# EAGLE design PCB-BMDShieldCon (EAGLE 7.7.0)

## Sheet 1 of 2
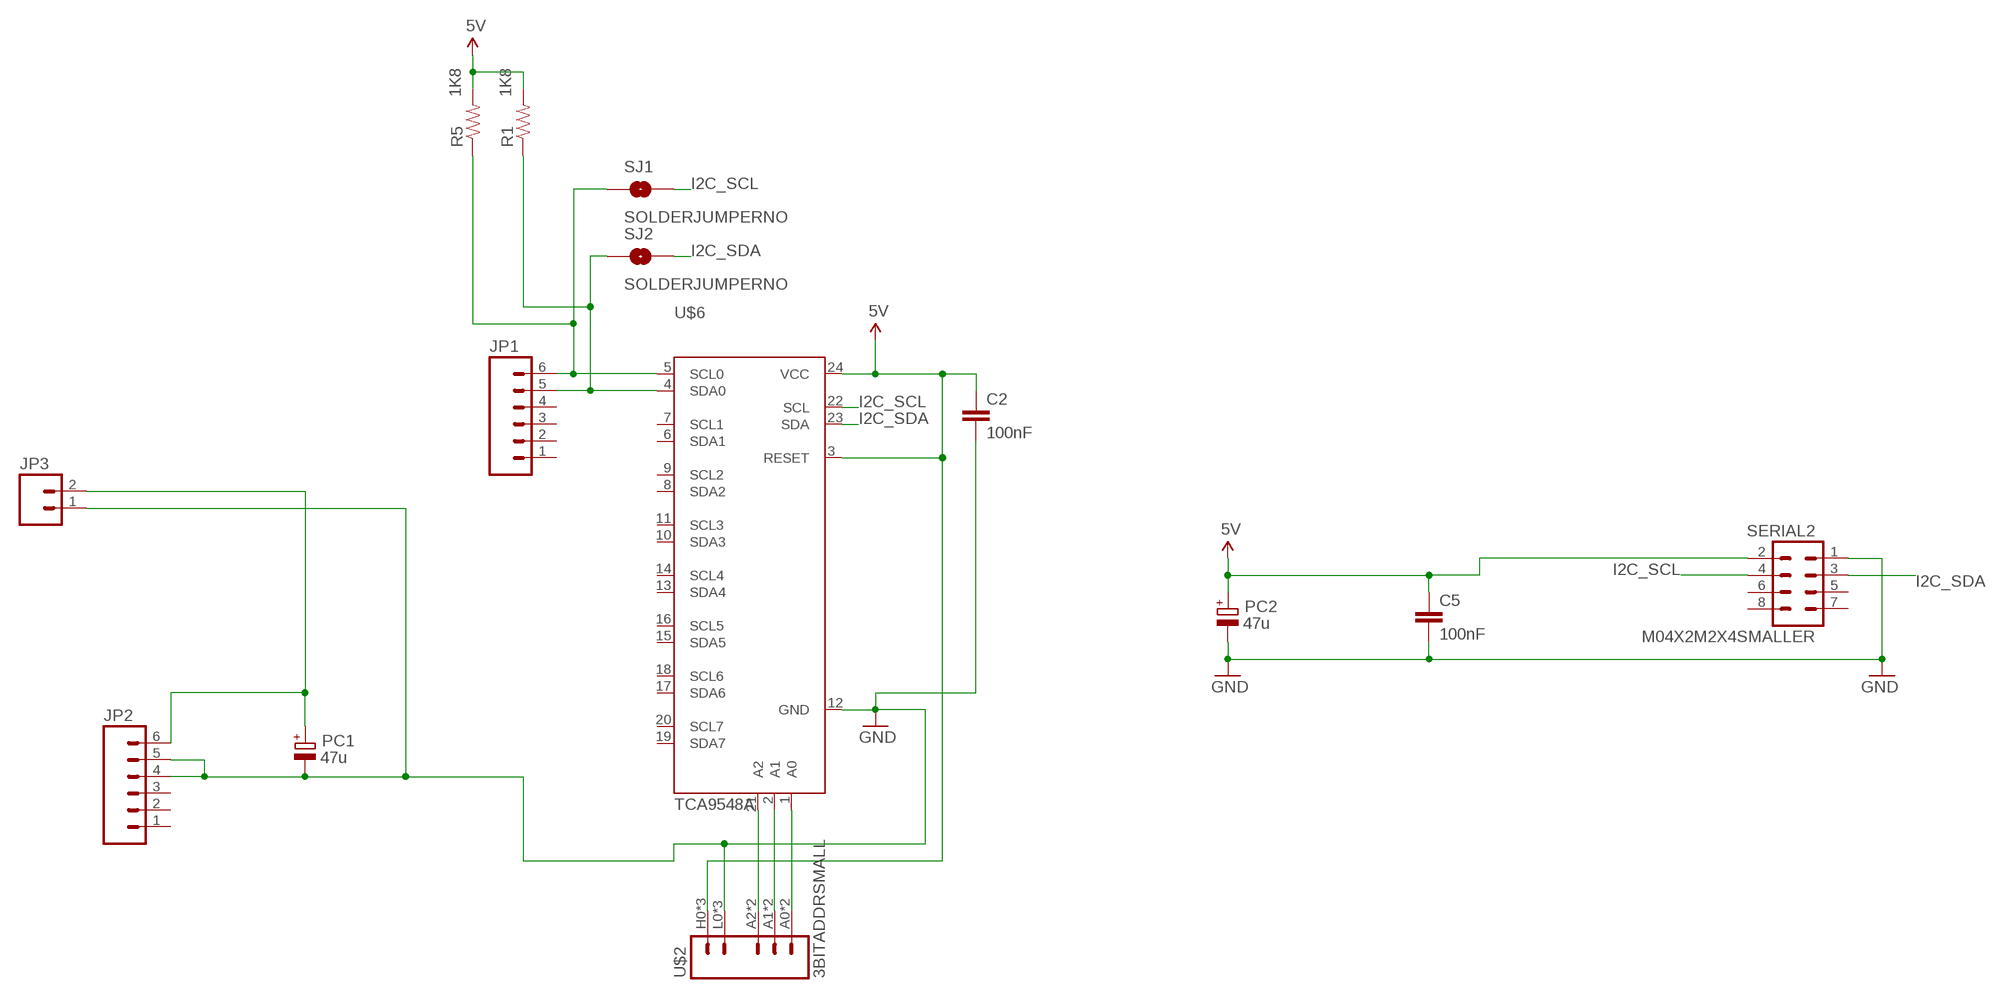
[diagram p0: schematic, sheet 1]

### Parts
C2  100nF  CAP0603-CAP  [0603-CAP]
C5  100nF  CAP0603-CAP  [0603-CAP]
JP1  M06SIP  [1X06]
JP2  M06SIP  [1X06]
JP3  M02PTH4  [1X02_XTRA_BIG]
PC1  47u  CPOL-EUD  [PANASONIC_D]
PC2  47u  CPOL-EUD  [PANASONIC_D]
R1  1K8  RESISTOR0603-RES  [0603-RES]
R5  1K8  RESISTOR0603-RES  [0603-RES]
SERIAL2  M04X2M2X4SMALLER  [M2X4SMALLER]
SJ1  SOLDERJUMPERNO  [SJ_2S-NO]
SJ2  SOLDERJUMPERNO  [SJ_2S-NO]
U$2  3BITADDRSMALL  [3BITADDR_SMALL]
U$6  TCA9548A  [TSSOP24]

### Nets
5V [Power]: C2.1 C5.1 PC2.+ R1.2 R5.2 SERIAL2.2 U$2.H0(VCC) U$2.H1(VCC) U$2.H2(VCC) U$6.3(RESET) U$6.24(VCC)
GND [Power]: C2.2 C5.2 JP2.4 JP2.5 JP3.1 PC1.- PC2.- SERIAL2.1 U$2.L0(GND) U$2.L1(GND) U$2.L2(GND) U$6.12(GND)
I2C_SCL: SERIAL2.4 SJ1.2 U$6.22(SCL)
I2C_SDA: SERIAL2.3 SJ2.2 U$6.23(SDA)
N$1: JP1.6 R5.1 SJ1.1 U$6.5(SCL0)
N$2 [Power]: JP2.6 JP3.2 PC1.+
N$3: JP1.5 R1.1 SJ2.1 U$6.4(SDA0)
N$4: U$2.A0 U$2.AS0(A0) U$6.1(A0)
N$5: U$2.A1 U$2.AS1(A1) U$6.2(A1)
N$6: U$2.A2 U$2.AS2(A2) U$6.21(A2)
Unconnected: JP1.1 JP1.2 JP1.3 JP1.4 JP2.1 JP2.2 JP2.3 SERIAL2.5 SERIAL2.6 SERIAL2.7 SERIAL2.8 U$6.6(SDA1) U$6.7(SCL1) U$6.8(SDA2) U$6.9(SCL2) U$6.10(SDA3) U$6.11(SCL3) U$6.13(SDA4) U$6.14(SCL4) U$6.15(SDA5) U$6.16(SCL5) U$6.17(SDA6) U$6.18(SCL6) U$6.19(SDA7) U$6.20(SCL7)

## Sheet 2 of 2

## Library data of the parts
C2 C5 = SparkFun:CAP: Capacitor Standard 0603 ceramic capacitor, and 0.1" leaded capacitor.
JP1 JP2 = SparkFun:M06: Header 6 Standard 6-pin 0.1" header. Use with straight break away headers (SKU : PRT-00116), right angle break away headers (PRT-00553), swiss pins (PRT-00743), machine pins (PRT-00117), and female headers (PRT-00115). Molex polarized connector foot print use with SKU : PRT-08094 with associated crimp pins and housings. NOTES ON THE VARIANTS LOCK and LOCK_LONGPADS... This footprint was designed to help hold the alignment of a through-hole component (i.e. 6-pin header) while soldering it into place. You may notice that each hole has been shifted either up or down by 0.005 of an inch from it's more standard position (which is a perfectly straight line). This slight alteration caused the pins (the squares in the middle) to touch the edges of the holes. Because they are alternating, it causes a "brace" to hold the component in place. 0.005 has proven to be the perfect amount of "off-center" position when using our standard breakaway headers. Although looks a little odd when you look at the bare footprint, once you have a header in there, the alteration is very hard to notice. Also, if you push a header all the way into place, it is covered up entirely on the bottom side. This idea of altering the position of holes to aid alignment will be further integrated into the Sparkfun Library for other footprints. It can help hold any component with 3 or more connection pins.
JP3 = SparkFun:M02: Header 2 Standard 2-pin 0.1" header. Use with straight break away headers (SKU : PRT-00116), right angle break away headers (PRT-00553), swiss pins (PRT-00743), machine pins (PRT-00117), and female headers (PRT-00115). Molex polarized connector foot print use with SKU : PRT-08233 with associated crimp pins and housings.
PC1 PC2 = rcl:CPOL-EU: POLARIZED CAPACITOR, European symbol
R1 R5 = SparkFun:RESISTOR: Resistor Basic schematic elements and footprints for 0603, 1206, and PTH resistors.; SKAARHOJ_ID: SK_1K8
SERIAL2 = SKAARHOJ:M04X2
SJ1 SJ2 = SparkFun:SOLDERJUMPER: Solder Jumper Standard SMD solder jumper. Used to automate production. Two varients : Normally Open and Normally Closed are the same, but have different paste layers. NC will have a large amount of paste and should jumper during reflow.
U$2 = SKAARHOJ:3BITADDR
U$6 = SKAARHOJ:TCA9548A

## Net classes
0 default: width 0.203 mm, drill 0.305 mm, clearance 0.203 mm
1 Power: width 0.406 mm, drill 0.61 mm, clearance 0.203 mm

## Board
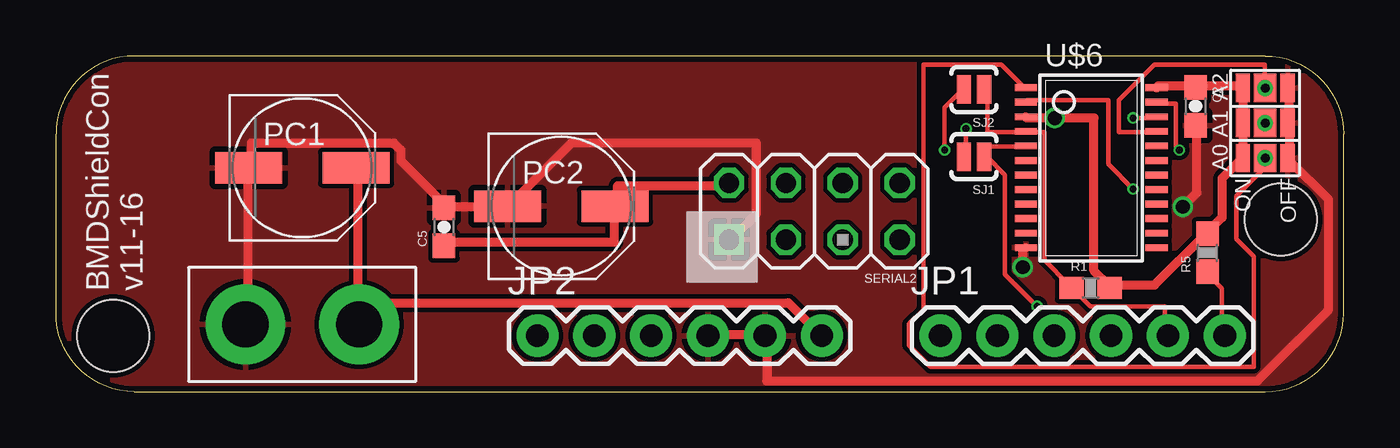
[diagram p1: board, top side]
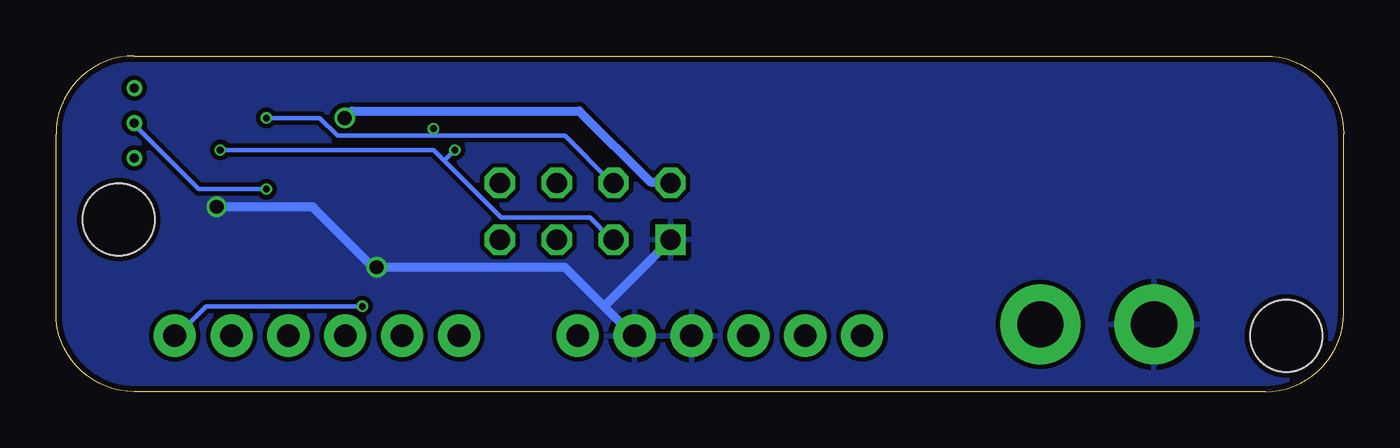
[diagram p2: board, bottom side, seen from below]

Size 57.5 x 15 mm. Coordinates in mm from the lower left corner, seen from the top.
Outline: 3.5,0 54,0 arc90 57.5,3.5 57.5,11.5 arc90 54,15 3.5,15 arc90 0,11.5 0,3.5 arc90 3.5,0
Copper layers (1*2*15*16): Top 0.035mm / dielectric 0.2mm / layer 2 0.0175mm / dielectric 0.3mm / layer 15 0.0175mm / dielectric 0.2mm / Bottom 0.035mm
Design rules "SeeedStudio_4layer_DRU_no_angle_20140221": minimum track width 8mil, minimum drill 12mil, track to track 8mil, track to pad 8mil, pad to pad 8mil, via to via 8mil, smd to smd 0mil, copper to edge 10mil, drill to drill 8mil, minimum pad ring 6mil, minimum via ring 4mil, stop-mask expansion 4mil, vias tented up to drill 100mil, thermal gap 10mil
Holes 3.2 mm at 2.55,2.49 54.7,7.69

### Footprints (pad centres in the part's own frame; a part is rotated, then mirrored left to right if it is on the bottom)
0603-CAP = smd 1.1 x 1: 1 -0.85,0; 2 0.85,0
1X06 = drill 1.016 pad 1.88: 1 0,0; 2 2.54,0; 3 5.08,0; 4 7.62,0; 5 10.16,0; 6 12.7,0
1X02_XTRA_BIG = drill 2.057 pad 3.556: 1 -2.54,0; 2 2.54,0
PANASONIC_D = smd 3 x 1.4: + 2.4,0; - -2.4,0
0603-RES = smd 1.1 x 1: 1 -0.85,0; 2 0.85,0
M2X4SMALLER = drill 0.9 square: 1 -1.27,3.81 | drill 0.9 octagon: 2 1.27,3.81; 3 -1.27,1.27; 4 1.27,1.27; 5 -1.27,-1.27; 6 1.27,-1.27; 7 -1.27,-3.81; 8 1.27,-3.81
SJ_2S-NO = smd 0.635 x 1.27: 1 -0.45,0; 2 0.45,0
3BITADDR_SMALL = drill 0.4: A0 -1.565,0; A1 0,0; A2 1.565,0 | smd 1.27 x 1: AS0 -1.565,0; AS1 0,0; AS2 1.565,0 | smd 1.27 x 0.635: H0 -1.565,1; H1 0,1; H2 1.565,1; L0 -1.565,-1; L1 0,-1; L2 1.565,-1
TSSOP24 = smd 0.305 x 0.991: 1 -4.225,-2.918; 2 -3.575,-2.918; 3 -2.925,-2.918; 4 -2.275,-2.918; 5 -1.625,-2.918; 6 -0.975,-2.918; 7 -0.325,-2.918; 8 0.325,-2.918; 9 0.975,-2.918; 10 1.625,-2.918; 11 2.275,-2.918; 12 2.925,-2.918; 13 2.925,2.918; 14 2.275,2.918; 15 1.625,2.918; 16 0.975,2.918; 17 0.325,2.918; 18 -0.325,2.918; 19 -0.975,2.918; 20 -1.625,2.918; 21 -2.275,2.918; 22 -2.925,2.918; 23 -3.575,2.918; 24 -4.225,2.918

### Placement (x,y rotation side)
C2  50.89,12.75 270 top
C5  17.33,7.36 90 top
JP1  39.5,2.5 0 top
JP2  21.5,2.5 0 top
JP3  11,3 0 top
PC1  11,10 0 top
PC2  22.57,8.29 0 top
R1  46.2,4.63 0 top
R5  51.42,6.2 90 top
SERIAL2  33.87,8.06 90 top
SJ1  41,10.5 180 top
SJ2  41,13.5 180 top
U$2  54,12 90 top
U$6  46.23,9.35 270 top

### Tracks (layer width: path | path; a pad name or v marks a point on that pad's centre or on a via)
5V  (via drill 0.61)
  Top 0.406: C5.1 17.46,6.67 24.92,6.67 24.92,8.26 PC2.+ 25.08,8.41 25.08,9.21 30,9.21 SERIAL2.2 | U$6.24 49.21,13.65 50.8,13.65 C2.1 50.96,13.65 52.86,13.65 U$2.H2 53.02,13.49 53.02,12.06 U$2.H1 53.02,11.91 53.02,10.64 U$2.H0 52.86,10.32 52.07,9.53 52.07,7.78 51.44,7.14 R5.2 51.28,6.99 49.05,4.76 47.15,4.76 R1.2 46.99,4.76 46.35,5.4 46.35,12.22 v44.61,12.22 43.34,12.22 U$6.3
  Bottom 0.406: v44.61,12.22 44.29,12.54 34.13,12.54 30.96,9.37 30.16,9.37 SERIAL2.2
GND  (via drill 0.61)
  Top 0.406: JP3.1 8.57,3.02 8.57,9.84 PC1.- 8.73,10.16 8.73,11.11 15.08,11.11 15.4,10.79 15.4,10.32 17.3,8.41 C5.2 17.46,8.26 20.16,8.26 PC2.- 20.32,8.41 23.02,11.11 31.27,11.11 31.27,7.94 30.16,6.83 SERIAL2.1 | U$2.L2 55.09,13.49 55.09,12.06 U$2.L1 55.09,11.91 55.09,10.48 U$2.L0 55.09,10.32 56.83,8.57 56.83,3.65 53.66,0.48 31.75,0.48 31.75,2.38 JP2.5 31.59,2.54 29.21,2.54 JP2.4 | v43.18,5.56 43.18,6.35 U$6.12 | v50.32,8.26 50.96,8.89 50.96,11.75 C2.2
  Bottom 0.406: 33.02,3.81 31.75,2.54 JP2.5 | 33.02,3.81 34.77,5.56 v43.18,5.56 43.34,5.56 46.04,8.26 v50.32,8.26 | 33.02,3.81 30.16,6.67 SERIAL2.1
  pour Top: 0,0 57.5,0 57.5,15 0,15
  pour Bottom: 0,0 57.5,0 57.5,15 0,15
I2C_SCL  (via drill 0.3)
  Top 0.203: v48.1,12.22 49.05,12.22 U$6.22 | v40.64,11.75 40.64,10.64 SJ1.2
  Bottom 0.203: v48.1,12.22 45.72,12.22 44.93,11.43 40.64,11.43 | 40.64,11.43 34.77,11.43 32.7,9.37 SERIAL2.4 | 40.64,11.43 v40.64,11.75
I2C_SDA  (via drill 0.3)
  Top 0.203: v50.16,10.79 50.01,10.95 50.01,12.86 49.21,12.86 U$6.23 | v39.69,10.79 39.69,12.7 40.48,13.49 SJ2.2
  Bottom 0.203: v50.16,10.79 40.64,10.79 40.16,10.32 | 40.16,10.32 37.62,7.78 33.66,7.78 32.7,6.83 SERIAL2.3 | 40.16,10.32 v39.69,10.79
N$1  (via drill 0.3)
  Top 0.203: U$6.5 43.18,10.95 41.59,10.95 41.59,10.64 SJ1.1 41.59,10.48 42.39,9.68 42.39,5.24 v43.81,3.81 | R5.1 51.44,5.24 52.07,4.6 52.07,2.54 JP1.6
  Bottom 0.203: v43.81,3.81 50.8,3.81 52.07,2.54 JP1.6
N$2
  Top 0.406: PC1.+ 13.49,9.84 13.49,3.02 JP3.2 13.65,3.97 32.7,3.97 34.13,2.54 JP2.6
N$3
  Top 0.203: SJ2.1 41.59,13.49 41.59,11.59 43.18,11.59 U$6.4 43.34,11.59 44.13,11.59 44.13,5.87 45.24,4.76 R1.1 45.4,4.6 46.2,3.81 49.53,3.81 49.53,2.54 JP1.5
N$4
  Top 0.203: U$6.1 43.18,13.65 42.23,14.61 38.73,14.61 38.73,3.65 38.1,3.02 38.1,2.06 39.05,1.11 53.5,1.11 53.5,6.03 52.7,6.83 52.7,8.73 53.98,10 53.98,10.32 U$2.A0 53.98,10.48
N$5  (via drill 0.3)
  Top 0.203: v48.1,9.05 46.99,10.16 46.99,13.02 43.34,13.02 U$6.2 | 54.13,12.06 U$2.AS1
  Bottom 0.203: v48.1,9.05 51.12,9.05 53.98,11.91 U$2.AS1
N$6
  Top 0.203: U$6.21 49.05,11.59 47.47,11.59 47.47,13.02 49.05,14.61 53.98,14.61 53.98,13.65 U$2.AS2

### Text on the board
KAP_MAAT1: GND | 12V
_tsilk: BMDShieldCon / v11-16